# EAGLE design SmodSLDR (EAGLE 6.3)
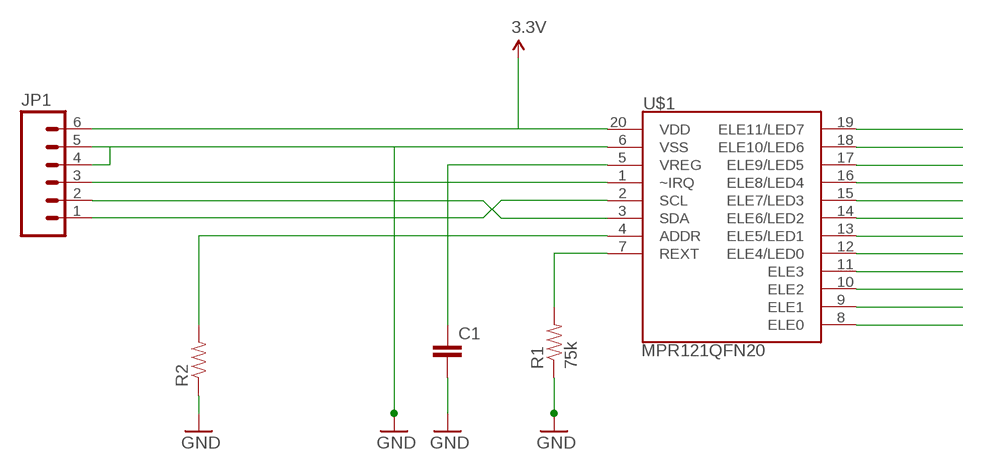
[diagram p0: schematic, sheet 1]

## Parts
C1  CAP0603-CAP  [0603-CAP]
JP1  M06SIP  [1X06]
R1  75k  RESISTOR0603-RES  [0603-RES]
R2  RESISTOR0603-RES  [0603-RES]
U$1  MPR121QFN20  [QFN-20-0.4MM]

## Nets
9: U$1.16(ELE8/LED4)
ADDR: R2.2 U$1.4(ADDR)
GND: C1.2 JP1.4 JP1.5 R1.1 R2.1 U$1.6(VSS)
N$3: U$1.19(ELE11/LED7)
N$8: U$1.18(ELE10/LED6)
N$9: U$1.17(ELE9/LED5)
N$11: U$1.15(ELE7/LED3)
N$12: U$1.14(ELE6/LED2)
N$13: U$1.13(ELE5/LED1)
N$14: U$1.12(ELE4/LED0)
N$15: U$1.11(ELE3)
N$16: U$1.10(ELE2)
N$17: U$1.9(ELE1)
N$18: U$1.8(ELE0)
REXT: R1.2 U$1.7(REXT)
SCL: JP1.1 U$1.2(SCL)
SDA: JP1.2 U$1.3(SDA)
VCC: JP1.6 U$1.20(VDD) ; supply symbol labelled 3.3V
VREG: C1.1 U$1.5(VREG)
~IRQ: JP1.3 U$1.1(~IRQ)

## Library data of the parts
C1 = SparkFun-Passives:CAP: Capacitor Standard 0603 ceramic capacitor, and 0.1" leaded capacitor.
JP1 = SparkFun:M06: Header 6 Standard 6-pin 0.1" header. Use with straight break away headers (SKU : PRT-00116), right angle break away headers (PRT-00553), swiss pins (PRT-00743), machine pins (PRT-00117), and female headers (PRT-00115). Molex polarized connector foot print use with SKU : PRT-08094 with associated crimp pins and housings. NOTES ON THE VARIANTS LOCK and LOCK_LONGPADS... This footprint was designed to help hold the alignment of a through-hole component (i.e. 6-pin header) while soldering it into place. You may notice that each hole has been shifted either up or down by 0.005 of an inch from it's more standard position (which is a perfectly straight line). This slight alteration caused the pins (the squares in the middle) to touch the edges of the holes. Because they are alternating, it causes a "brace" to hold the component in place. 0.005 has proven to be the perfect amount of "off-center" position when using our standard breakaway headers. Although looks a little odd when you look at the bare footprint, once you have a header in there, the alteration is very hard to notice. Also, if you push a header all the way into place, it is covered up entirely on the bottom side. This idea of altering the position of holes to aid alignment will be further integrated into the Sparkfun Library for other footprints. It can help hold any component with 3 or more connection pins.
R1 R2 = SparkFun-Passives:RESISTOR: Resistor Basic schematic elements and footprints for 0603, 1206, and PTH resistors.
U$1 = SparkFun-Sensors:MPR121: MPR121 Capacitive Touch Sensor Controller

## Board
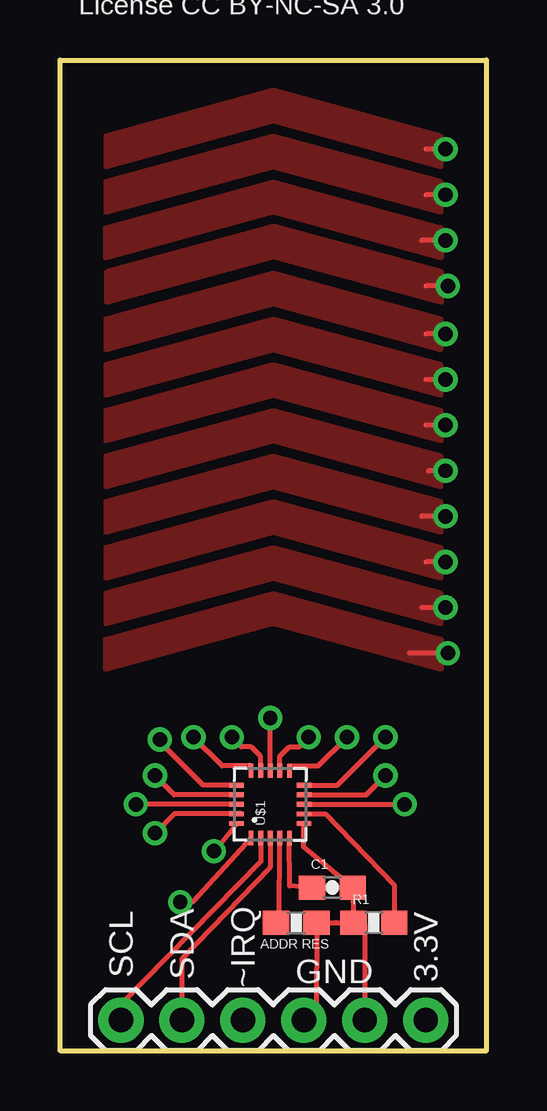
[diagram p1: board, top side]
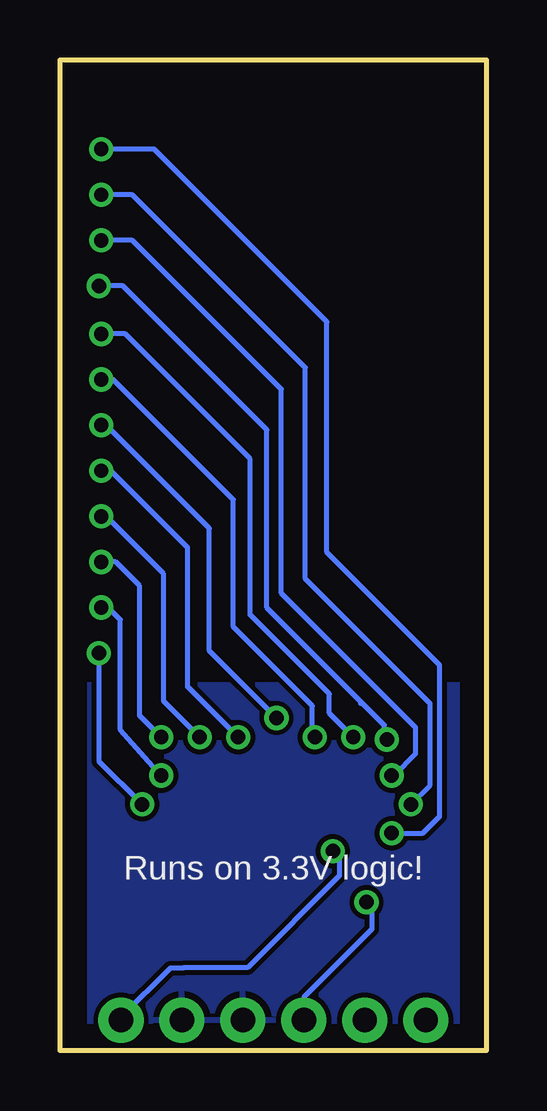
[diagram p2: board, bottom side, seen from below]

Size 17.78 x 41.27 mm. Coordinates in mm from the lower left corner, seen from the top.
Outline: 0,0 17.78,0 17.78,41.27 0,41.27 0,0
Copper layers (1*16): Top 0.035mm / dielectric 1.5mm / Bottom 0.035mm
Design rules "default": minimum track width 10mil, minimum drill 24mil, track to track 8mil, track to pad 8mil, pad to pad 8mil, via to via 8mil, smd to smd 8mil, copper to edge 40mil, drill to drill 8mil, minimum pad ring 10mil, minimum via ring 8mil, stop-mask expansion 4mil, vias tented up to drill 0mil, thermal gap 10mil

### Footprints (pad centres in the part's own frame; a part is rotated, then mirrored left to right if it is on the bottom)
0603-CAP = smd 1.1 x 1: 1 -0.85,0; 2 0.85,0
1X06 = drill 1.016 pad 1.88: 1 0,0; 2 2.54,0; 3 5.08,0; 4 7.62,0; 5 10.16,0; 6 12.7,0
0603-RES = smd 1.1 x 1: 1 -0.85,0; 2 0.85,0
QFN-20-0.4MM = smd 0.6 x 0.2: 1 -1.4,0.8; 2 -1.4,0.4; 3 -1.4,0; 4 -1.4,-0.4; 5 -1.4,-0.8; 11 1.4,-0.8; 12 1.4,-0.4; 13 1.4,0; 14 1.4,0.4; 15 1.4,0.8 | smd 0.2 x 0.6: 6 -0.8,-1.4; 7 -0.4,-1.4; 8 0,-1.4; 9 0.4,-1.4; 10 0.8,-1.4; 16 0.8,1.4; 17 0.4,1.4; 18 0,1.4; 19 -0.4,1.4; 20 -0.8,1.4

### Placement (x,y rotation side)
C1  11.35,6.8 0 top
JP1  2.54,1.27 0 top
R1  13.08,5.34 0 top
R2  9.84,5.33 180 top
U$1  8.76,10.26 90 top

### Tracks (layer width: path | path; a pad name or v marks a point on that pad's centre or on a via)
1  (via drill 0.6)
  Top 0.2: 9.96,10.26 v14.36,10.26 | v16.16,16.56 14.56,16.56
  Bottom 0.2: v14.36,10.26 16.16,12.06 v16.16,16.56
  pour Top: 1.9,17.14 8.89,19.05 15.87,17.14 15.87,15.88 8.89,17.78 1.9,15.88
2  (via drill 0.6)
  Top 0.2: 9.96,10.66 12.76,10.66 v13.56,11.46 | v16.06,18.46 15.06,18.46
  Bottom 0.2: v13.56,11.46 15.26,13.36 15.26,17.96 15.76,18.46 v16.06,18.46
  pour Top: 1.9,17.78 8.89,19.69 15.87,17.78 15.87,19.05 8.89,20.96 1.9,19.05
3  (via drill 0.6)
  Top 0.2: 10.36,11.06 11.56,11.06 v13.56,13.06 | v16.06,20.36 15.26,20.36
  Bottom 0.2: v13.56,13.06 14.46,13.96 14.46,19.36 15.46,20.36 v16.06,20.36
  pour Top: 1.9,19.69 8.89,21.59 15.87,19.69 15.87,20.96 8.89,22.86 1.9,20.96
4  (via drill 0.6)
  Top 0.2: 9.56,11.86 10.76,11.86 v11.96,13.06 | v16.06,22.26 15.06,22.26
  Bottom 0.2: v11.96,13.06 13.46,14.56 13.46,19.86 15.86,22.26 v16.06,22.26
  pour Top: 1.9,21.59 8.89,23.5 15.87,21.59 15.87,22.86 8.89,24.77 1.9,22.86
5  (via drill 0.6)
  Top 0.2: 9.16,11.46 9.16,12.26 9.56,12.66 9.96,12.66 v10.36,13.06 | v16.06,24.16 15.36,24.16
  Bottom 0.2: v10.36,13.06 12.46,15.16 12.46,20.96 15.66,24.16 v16.06,24.16
  pour Top: 1.9,23.5 8.89,25.4 15.87,23.5 15.87,24.77 8.89,26.67 1.9,24.77
6  (via drill 0.6)
  Top 0.2: 8.76,11.86 v8.76,13.86 | v16.06,26.06 15.26,26.06
  Bottom 0.2: v8.76,13.86 11.56,16.66 11.56,21.76 15.86,26.06 v16.06,26.06
  pour Top: 1.9,25.4 8.89,27.3 15.87,25.4 15.87,26.67 8.89,28.57 1.9,26.67
7  (via drill 0.6)
  Top 0.2: 8.36,11.46 8.36,12.26 7.96,12.66 7.56,12.66 v7.16,13.06 | v16.06,27.96 15.26,27.96
  Bottom 0.2: v7.16,13.06 7.26,13.16 7.26,14.36 10.56,17.66 10.56,22.96 15.56,27.96 v16.06,27.96
  pour Top: 1.9,27.3 8.89,29.21 15.87,27.3 15.87,28.57 8.89,30.48 1.9,28.57
8  (via drill 0.6)
  Top 0.2: 7.96,11.46 7.96,11.86 6.76,11.86 v5.56,13.06 | v16.06,29.86 15.26,29.86
  Bottom 0.2: v5.56,13.06 6.56,14.06 6.56,14.86 9.86,18.16 9.86,24.66 15.06,29.86 v16.06,29.86
  pour Top: 1.9,29.21 8.89,31.12 15.87,29.21 15.87,30.48 8.89,32.38 1.9,30.48
9  (via drill 0.6)
  Top 0.2: U$1.16 5.96,11.06 4.16,12.86 v4.16,12.96 | v16.16,31.86 15.26,31.86
  Bottom 0.2: v4.16,12.96 4.26,13.06 4.26,13.56 5.16,14.46 | 5.16,14.46 5.26,14.46 | 5.16,14.46 9.16,18.46 9.16,25.86 15.16,31.86 v16.16,31.86
  pour Top: 1.93,31.18 8.92,33.08 15.9,31.18 15.9,32.45 8.92,34.35 1.93,32.45
10  (via drill 0.6)
  Top 0.2: v16.06,33.76 15.06,33.76
  Bottom 0.2: 3.86,11.46 2.96,12.36 2.96,13.46 8.56,19.06 8.56,27.56 14.76,33.76 v16.06,33.76
  pour Top: 1.9,33.02 1.9,34.29 8.89,36.2 15.87,34.29 15.87,33.02 8.89,34.93
11  (via drill 0.6)
  Top 0.2: 7.56,10.26 v3.16,10.26 | v16.06,35.66 15.26,35.66
  Bottom 0.2: v3.16,10.26 2.36,11.06 2.36,14.46 7.56,19.66 7.56,28.46 14.76,35.66 v16.06,35.66
  pour Top: 1.9,34.93 8.89,36.83 15.87,34.93 15.87,36.2 8.89,38.1 1.9,36.2
12  (via drill 0.6)
  Top 0.2: 7.56,9.86 4.76,9.86 v3.96,9.06 | v16.06,37.56 15.26,37.56
  Bottom 0.2: v3.96,9.06 2.66,9.06 1.96,9.76 1.96,16.06 6.66,20.76 6.66,30.36 13.86,37.56 v16.06,37.56
  pour Top: 1.9,36.83 8.89,38.73 15.87,36.83 15.87,38.1 8.89,40.01 1.9,38.1
ADDR
  Top 0.2: R2.2 9.14,5.41 U$1.4
ELEC9  (via drill 0.6)
  Top 0.2: 7.56,10.66 4.76,10.66 v3.96,11.46
GND
  Top 0.2: R1.1 11.5,5.34 R2.1 10.67,1.54 JP1.4 | R1.1 12.7,5.24 JP1.5 | R1.1 12.23,5.56 C1.2 10.15,8.48 U$1.6
  pour Bottom: 0,0 17.78,0 17.78,15.24 0,15.24
REXT
  Top 0.2: U$1.7 11.06,9.86 13.93,6.89 R1.2
SCL
  Top 0.2: U$1.2 8.37,8.75 8.37,7.89 2.54,1.94 JP1.1
SDA
  Top 0.2: U$1.3 8.76,7.65 5.08,3.83 JP1.2
VCC  (via drill 0.6)
  Top 0.2: U$1.20 6.44,8.31 v6.41,8.31
  Bottom 0.2: v6.41,8.31 6.13,8.04 6.13,7.28 9.96,3.46 12.61,3.46 12.63,3.43 13.19,3.43 15.24,1.38 JP1.6
VREG
  Top 0.2: C1.1 9.57,6.87 U$1.5
~IRQ  (via drill 0.6)
  Top 0.2: U$1.1 5.54,6.21 5.53,6.21 5.51,6.18 v5.01,6.18
  Bottom 0.2: v5.01,6.18 4.78,5.96 4.78,5.06 7.62,2.22 JP1.3

### Text on the board
_tsilk: License CC BY-NC-SA 3.0 | SCL | SDA | ~IRQ | ADDR RES | 3.3V | GND
_bsilk: Smod - Slider / Designed by Shannon Strutz / for the University of Wiconsin - Stout / UW-Stout IEEE 2013 | Runs on 3.3V logic!